# EAGLE design RFM (EAGLE 7.4.0)
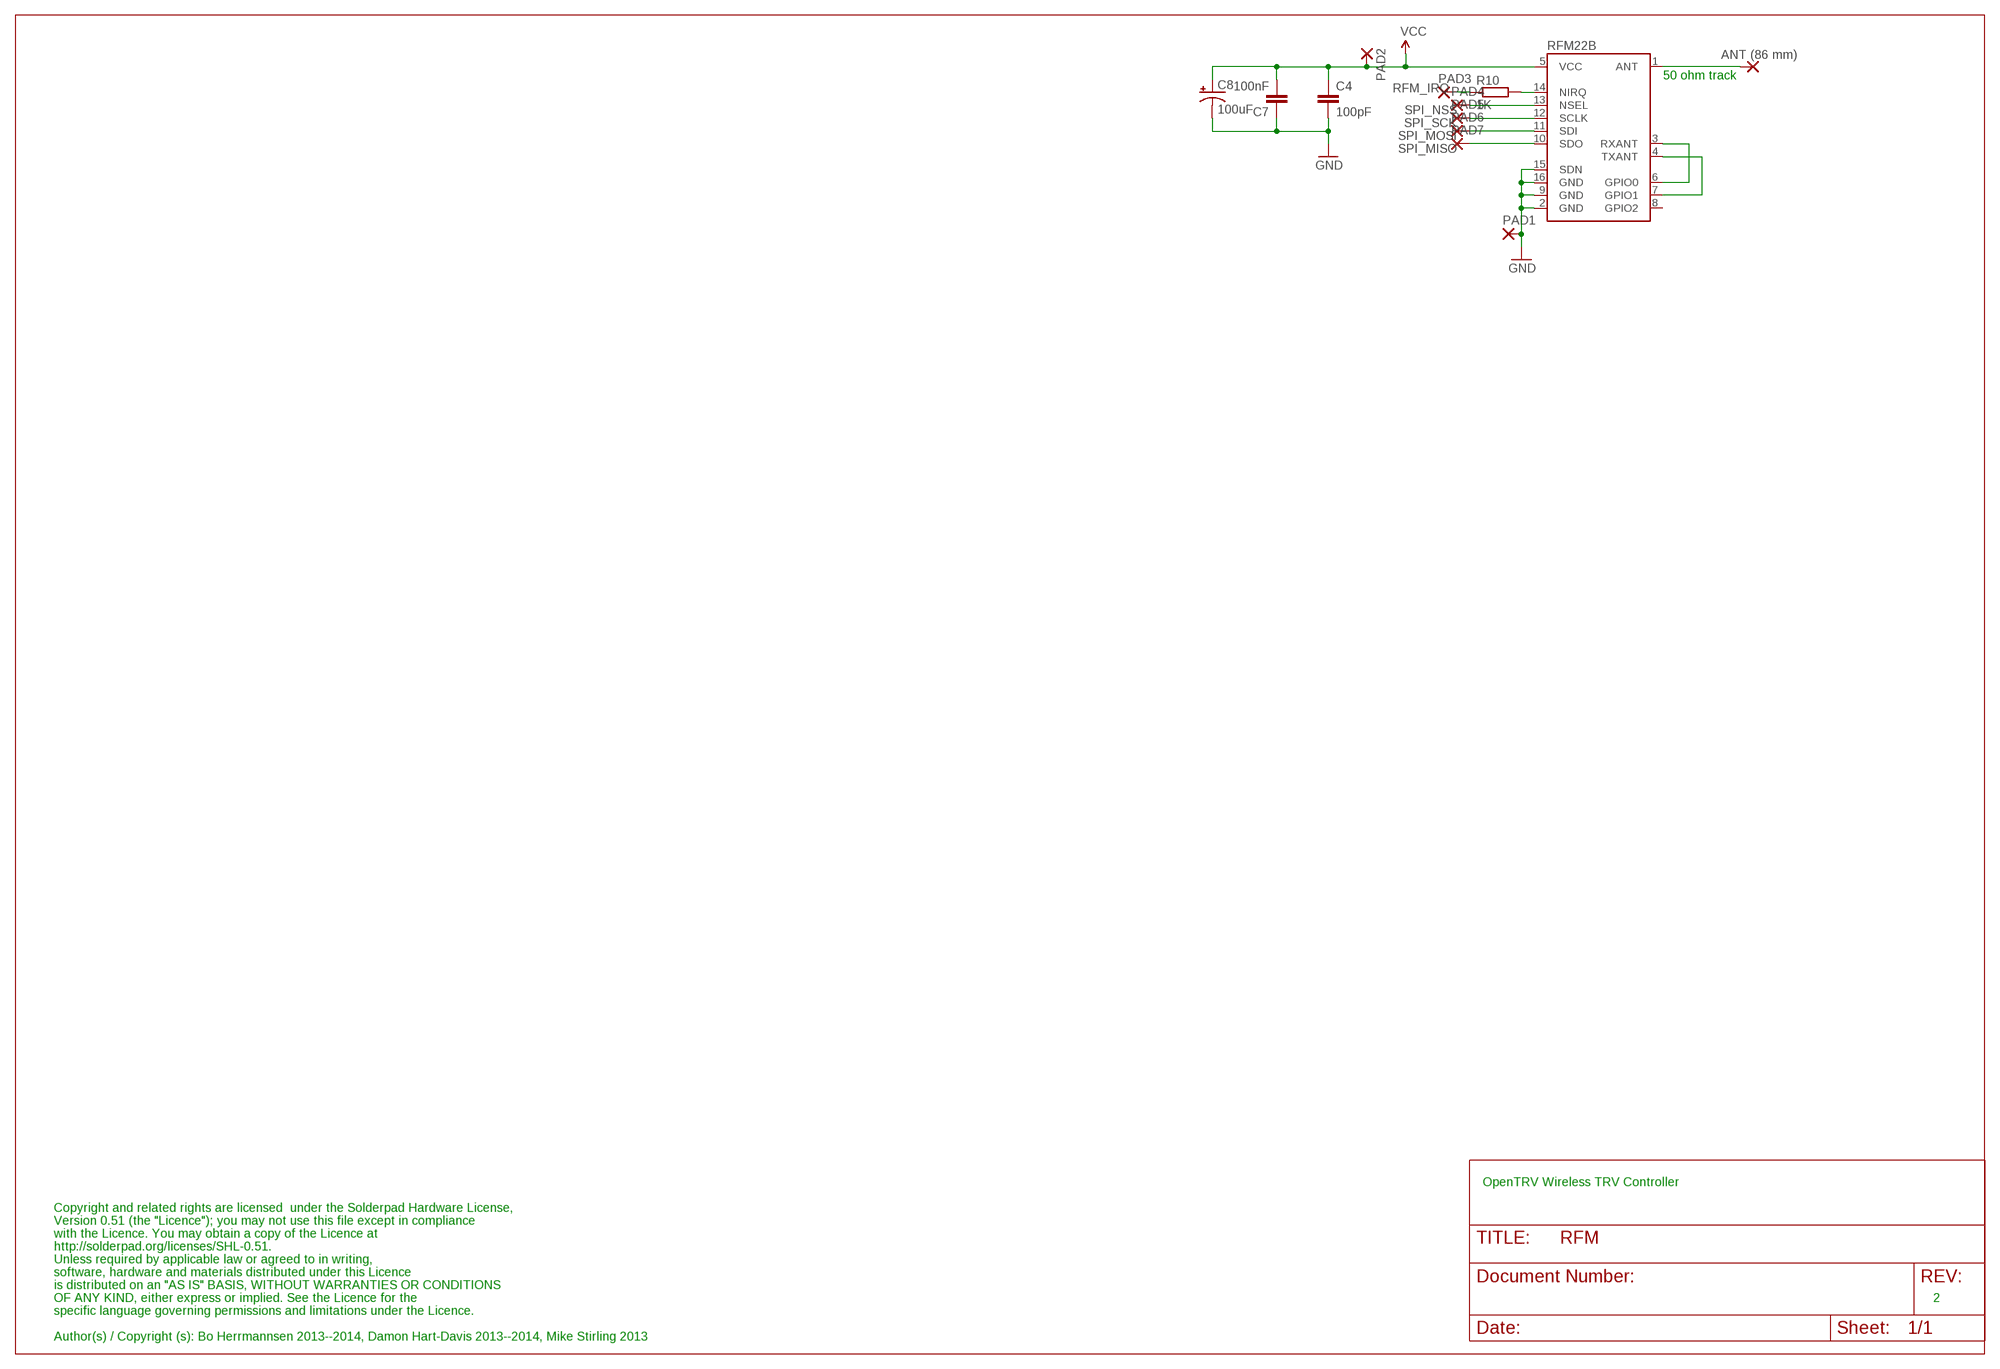
[diagram p0: schematic, sheet 1]

## Parts
ANT  ANT (86 mm)  2,15/1,0  [2,15/1,0]
C4  100pF  CAP0603-CAP  [0603-CAP]
C7  100nF  CAP0603-CAP  [0603-CAP]
C8  100uF  CAP_POL1206  [EIA3216]
PAD1  1,6/0,8  [1,6/0,8]
PAD2  1,6/0,8  [1,6/0,8]
PAD3  1,6/0,8  [1,6/0,8]
PAD4  1,6/0,8  [1,6/0,8]
PAD5  1,6/0,8  [1,6/0,8]
PAD6  1,6/0,8  [1,6/0,8]
PAD7  1,6/0,8  [1,6/0,8]
R10  1K  R-EU_R0603  [R0603]
RFM22B  RFM22SMD  [RFM22-XXX-S2]

## Nets
GND [supply]: C4.2 C7.1 C8.C(-) PAD1.1(P) RFM22B.2(GND) RFM22B.9(GND) RFM22B.15(SDN) RFM22B.16(GND)
N$7: R10.2 RFM22B.14(NIRQ)
N$20: RFM22B.3(RXANT) RFM22B.6(GPIO0)
N$21: RFM22B.4(TXANT) RFM22B.7(GPIO1)
N$26 [ant]: ANT.1(P) RFM22B.1(ANT)
RFM_IRQ: PAD3.1(P) R10.1
SPI_MISO: PAD7.1(P) RFM22B.10(SDO)
SPI_MOSI: PAD6.1(P) RFM22B.11(SDI)
SPI_NSS: PAD4.1(P) RFM22B.13(NSEL)
SPI_SCK: PAD5.1(P) RFM22B.12(SCLK)
VCC [supply]: C4.1 C7.2 C8.A(+) PAD2.1(P) RFM22B.5(VCC)
Unconnected: RFM22B.8(GPIO2)

## Notes on the sheet
- 50 ohm track
- OpenTRV Wireless TRV Controller
- Copyright and related rights are licensed  under the Solderpad Hardware License,
- Version 0.51 (the "Licence"); you may not use this file except in compliance
- with the Licence. You may obtain a copy of the Licence at
- http://solderpad.org/licenses/SHL-0.51.
- Unless required by applicable law or agreed to in writing,
- software, hardware and materials distributed under this Licence
- is distributed on an "AS IS" BASIS, WITHOUT WARRANTIES OR CONDITIONS
- OF ANY KIND, either express or implied. See the Licence for the | 2
- specific language governing permissions and limitations under the Licence.
- Author(s) / Copyright (s): Bo Herrmannsen 2013--2014, Damon Hart-Davis 2013--2014, Mike Stirling 2013

## Library data of the parts
ANT = wirepad:2,15/1,0: THROUGH-HOLE PAD
C4 C7 = SparkFun-Passives:CAP: Capacitor Standard 0603 ceramic capacitor, and 0.1" leaded capacitor.
C8 = SparkFun-Passives:CAP_POL: Capacitor Polarized These are standard SMD and PTH capacitors. Normally 10uF, 47uF, and 100uF in electrolytic and tantalum varieties. Always verify the external diameter of the through hole cap, it varies with capacity, voltage, and manufacturer. The EIA devices should be standard.
PAD1-PAD7 = wirepad:1,6/0,8: THROUGH-HOLE PAD
R10 = resistor:R-EU_: RESISTOR, European symbol
RFM22B = SparkFun-RF:RFM22: The RFM22 is a low-power, low cost radio that is capable of operating in the 434MHz and 900MHz open bands. It's frequency is software defined and there are some very good libraries written for it.

## Net classes
0 default: width 0.203 mm
1 supply: width 0.406 mm, clearance 0.203 mm
2 ant: width 2.184 mm

## Board
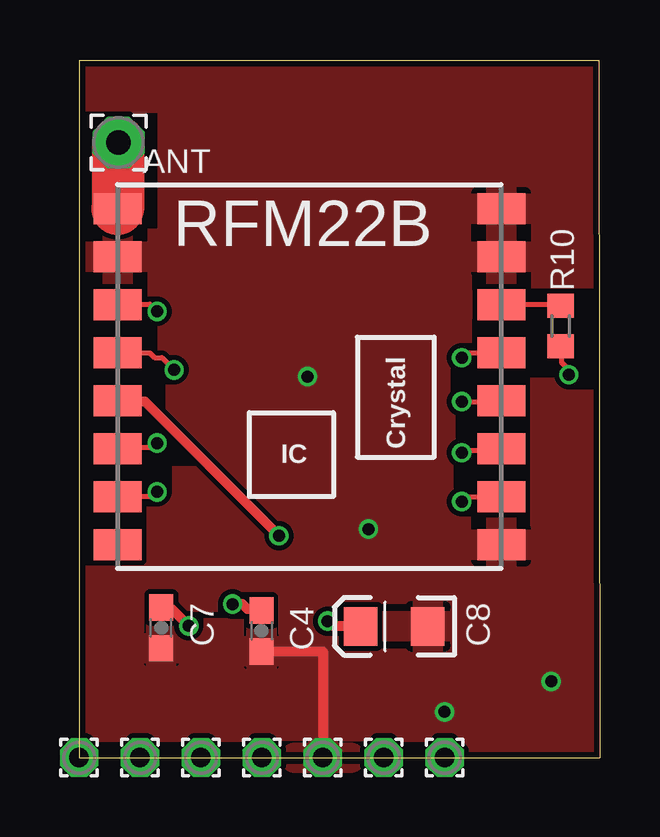
[diagram p1: board, top side]
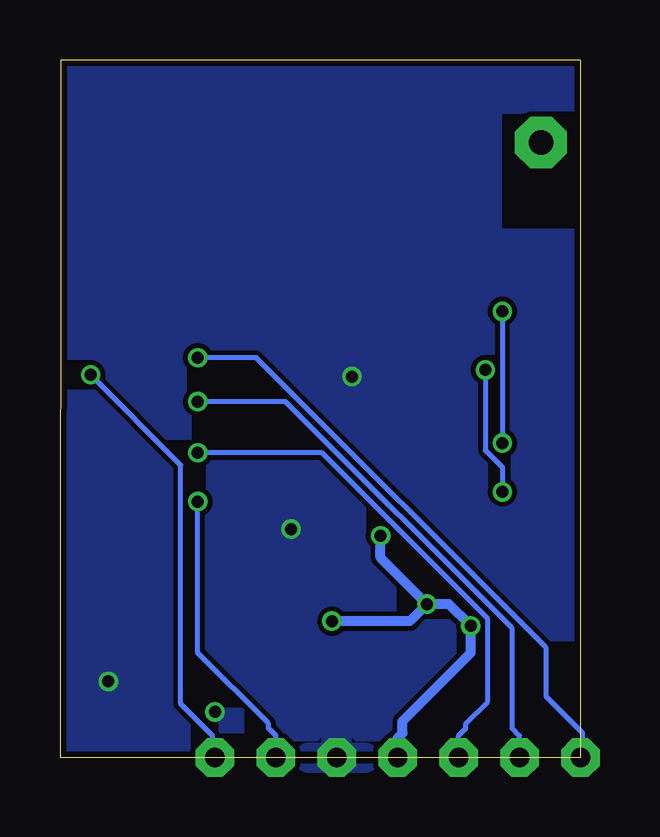
[diagram p2: board, bottom side, seen from below]

Size 21.7 x 29.07 mm. Coordinates in mm from the lower left corner, seen from the top.
Outline: 0,0 21.7,0 21.66,29.07 0,29.07 0,0
Copper layers (1*16): Top 0.035mm / dielectric 1.5mm / Bottom 0.035mm
Design rules "PMServicesStd *": minimum track width 8mil, minimum drill 0.5mm, track to track 8mil, track to pad 8mil, pad to pad 8mil, via to via 8mil, smd to smd 0mil, copper to edge 10mil, drill to drill 10mil, minimum pad ring 10mil, minimum via ring 6mil, stop-mask expansion 2mil, vias tented up to drill 100mil, thermal gap 10mil

### Footprints (pad centres in the part's own frame; a part is rotated, then mirrored left to right if it is on the bottom)
2,15/1,0 = drill 1.016 pad 2.159 octagon: 1 0,0
0603-CAP = smd 1.1 x 1: 1 -0.85,0; 2 0.85,0
EIA3216 = smd 1.4 x 1.6: A 1.4,0; C -1.4,0
1,6/0,8 = drill 0.813 pad 1.6 octagon: 1 0,0
R0603 = smd 1 x 1.1: 1 -0.85,0; 2 0.85,0
RFM22-XXX-S2 = smd 2 x 1.3: 1 -8,7; 2 -8,5; 3 -8,3; 4 -8,1; 5 -8,-1; 6 -8,-3; 7 -8,-5; 8 -8,-7; 9 8,-7; 10 8,-5; 11 8,-3; 12 8,-1; 13 8,1; 14 8,3; 15 8,5; 16 8,7

### Placement (x,y rotation side)
ANT  1.64,25.63 0 top
C4  7.6,5.28 270 top
C7  3.42,5.41 90 top
C8  13.14,5.47 180 top
PAD1  10.16,0 0 top
PAD2  7.62,0 0 top
PAD3  15.24,0 0 top
PAD4  0,0 0 top
PAD5  2.54,0 0 top
PAD6  5.08,0 0 top
PAD7  12.7,0 0 top
R10  20.08,17.98 90 top
RFM22B  9.6,15.87 0 top

### Tracks (layer width: path | path; a pad name or v marks a point on that pad's centre or on a via)
GND  (via drill 0.5)
  Top 0.406: C4.2 10.16,4.43 PAD1.1
  other vias: 9.53,15.88 19.68,3.17 12.06,9.53 15.24,1.91
  pour Bottom: 0,0 21.7,0 21.57,29.07 -0.04,29.07 0,27.5 2.6,27.5 2.6,27.42 3.91,27.47 3.91,21.41 0,21.41
  pour Top: 0,21.41 0,0 21.7,0 21.66,29.07 -0.04,29.07 0,27.5 3.88,27.5 3.91,27.42 3.91,21.41
N$7
  Top 0.203: R10.2 20.02,18.9 17.68,18.9 RFM22B.14
N$20  (via drill 0.5)
  Top 0.203: v3.25,13.11 3.05,12.9 1.63,12.9 RFM22B.6 | v3.25,18.59 2.95,18.9 1.63,18.9 RFM22B.3
  Bottom 0.203: v3.25,18.59 v3.25,13.11
N$21  (via drill 0.5)
  Top 0.203: v3.25,11.07 3.15,11.07 2.95,10.87 1.63,10.87 RFM22B.7 | v3.96,16.15 3.45,16.66 3.15,16.66 2.95,16.87 1.63,16.87 RFM22B.4
  Bottom 0.203: v3.25,11.07 3.25,12.09 3.96,12.8 v3.96,16.15
N$26
  Top 2.184: RFM22B.1 1.63,22.96 1.63,25.6 ANT.1
RFM_IRQ  (via drill 0.5)
  Top 0.203: v20.42,15.95 20.42,16.15 20.12,16.46 20.12,17.07 R10.1
  Bottom 0.203: v20.42,15.95 16.66,12.19 16.66,2.23 15.34,0.91 15.34,0.1 PAD3.1
SPI_MISO  (via drill 0.5)
  Top 0.203: v15.95,10.67 16.15,10.87 17.58,10.87 RFM22B.10
  Bottom 0.203: v15.95,10.67 15.95,4.37 13.01,1.42 13.01,1.22 12.7,0.91 PAD7.1
SPI_MOSI  (via drill 0.5)
  Top 0.203: v15.95,12.7 16.05,12.8 17.58,12.8 RFM22B.11
  Bottom 0.203: v15.95,12.7 10.77,12.7 3.86,5.79 3.86,2.34 4.78,1.42 4.78,1.22 5.08,0.91 PAD6.1
SPI_NSS  (via drill 0.5)
  Top 0.203: v15.95,16.66 16.05,16.66 16.26,16.87 17.58,16.87 RFM22B.13
  Bottom 0.203: v15.95,16.66 13.51,16.66 1.42,4.57 1.42,2.54 -0.1,1.02 -0.1,0.1 PAD4.1
SPI_SCK  (via drill 0.5)
  Top 0.203: v15.95,14.83 17.58,14.83 RFM22B.12
  Bottom 0.203: v15.95,14.83 12.29,14.83 2.85,5.38 2.85,1.22 2.54,0.91 PAD5.1
VCC  (via drill 0.5)
  Top 0.406: v4.57,5.49 3.86,6.2 3.45,6.2 C7.2 | v6.4,6.4 6.81,6.4 7.01,6.2 7.52,6.2 C4.1 | v10.36,5.69 10.57,5.49 11.68,5.49 C8.A | v8.33,9.25 2.74,14.83 1.63,14.83 RFM22B.5
  Bottom 0.406: PAD2.1 7.62,0.81 7.42,1.02 7.42,1.52 4.57,4.37 v4.57,5.49 5.49,6.4 v6.4,6.4 | v10.36,5.69 7.11,5.69 v6.4,6.4 | v8.33,9.25 8.33,8.33 v6.4,6.4